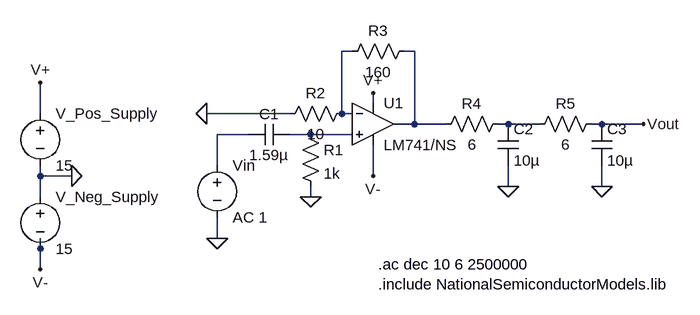
[diagram p0: schematic Project2Final.asc]
Project2Final.asc, the LTspice schematic file:
Version 4
SHEET 1 880 680
WIRE 144 16 128 16
WIRE 240 16 224 16
WIRE 176 96 176 80
WIRE -336 112 -336 64
WIRE 48 112 -80 112
WIRE 128 112 128 16
WIRE 144 112 128 112
WIRE 240 128 240 16
WIRE 240 128 208 128
WIRE 288 128 240 128
WIRE 384 128 368 128
WIRE 432 128 384 128
WIRE 528 128 512 128
WIRE 592 128 528 128
WIRE -16 144 -64 144
WIRE 80 144 48 144
WIRE 144 144 80 144
WIRE -64 192 -64 144
WIRE -336 208 -336 192
WIRE -288 208 -336 208
WIRE 176 208 176 160
WIRE 384 224 384 192
WIRE 528 224 528 192
WIRE -336 240 -336 208
WIRE 80 240 80 224
WIRE -64 304 -64 272
WIRE -336 320 -336 304
WIRE -336 352 -336 320
FLAG -64 304 0
FLAG 80 240 0
FLAG -80 112 0
FLAG 384 224 0
FLAG 528 224 0
FLAG 592 128 Vout
FLAG 176 80 V+
FLAG 176 208 V-
FLAG -336 64 V+
FLAG -336 352 V-
FLAG -288 208 0
SYMBOL voltage -64 176 R0
SYMATTR InstName Vin
SYMATTR Value AC 1
SYMBOL Opamps\\opamp2 176 64 R0
SYMATTR InstName U1
SYMATTR Value LM741/NS
SYMATTR SpiceModel LM741/NS
SYMATTR Value2 LM741/NS
SYMBOL cap 48 128 R90
WINDOW 0 0 32 VBottom 2
WINDOW 3 32 32 VTop 2
SYMATTR InstName C1
SYMATTR Value 1.59µ
SYMBOL res 64 128 R0
SYMATTR InstName R1
SYMATTR Value 1k
SYMBOL res 32 128 R270
WINDOW 0 32 56 VTop 2
WINDOW 3 0 56 VBottom 2
SYMATTR InstName R2
SYMATTR Value 10
SYMBOL res 240 0 R90
WINDOW 0 0 56 VBottom 2
WINDOW 3 32 56 VTop 2
SYMATTR InstName R3
SYMATTR Value 160
SYMBOL res 384 112 R90
WINDOW 0 0 56 VBottom 2
WINDOW 3 32 56 VTop 2
SYMATTR InstName R4
SYMATTR Value 6
SYMBOL cap 368 128 R0
SYMATTR InstName C2
SYMATTR Value 10µ
SYMBOL cap 512 128 R0
SYMATTR InstName C3
SYMATTR Value 10µ
SYMBOL voltage -336 224 R0
SYMATTR InstName V_Neg_Supply
SYMATTR Value 15
SYMBOL voltage -336 96 R0
SYMATTR InstName V_Pos_Supply
SYMATTR Value 15
SYMBOL res 528 112 R90
WINDOW 0 0 56 VBottom 2
WINDOW 3 32 56 VTop 2
SYMATTR InstName R5
SYMATTR Value 6
TEXT 184 344 Left 2 !.ac dec 10 6 2500000\n.include NationalSemiconductorModels.lib

The netlist it stands for:
* Project2Final.asc
Vin N004 0 AC 1
XU1 N005 N001 V+ V- N002 LM741/NS LM741/NS LM741/NS  ; pins In+ In- V+ V- OUT
C1 N005 N004 1.59µ
R1 N005 0 1k
R2 0 N001 10
R3 N002 N001 160
R4 N003 N002 6
C2 N003 0 10µ
C3 Vout 0 10µ
V_Neg_Supply 0 V- 15
V_Pos_Supply V+ 0 15
R5 Vout N003 6
.ac dec 10 6 2500000
.include NationalSemiconductorModels.lib
.backanno
.end